# Altium schematic sheet relay.SchDoc
size B; SheetNumber: 2; SheetTotal: 6
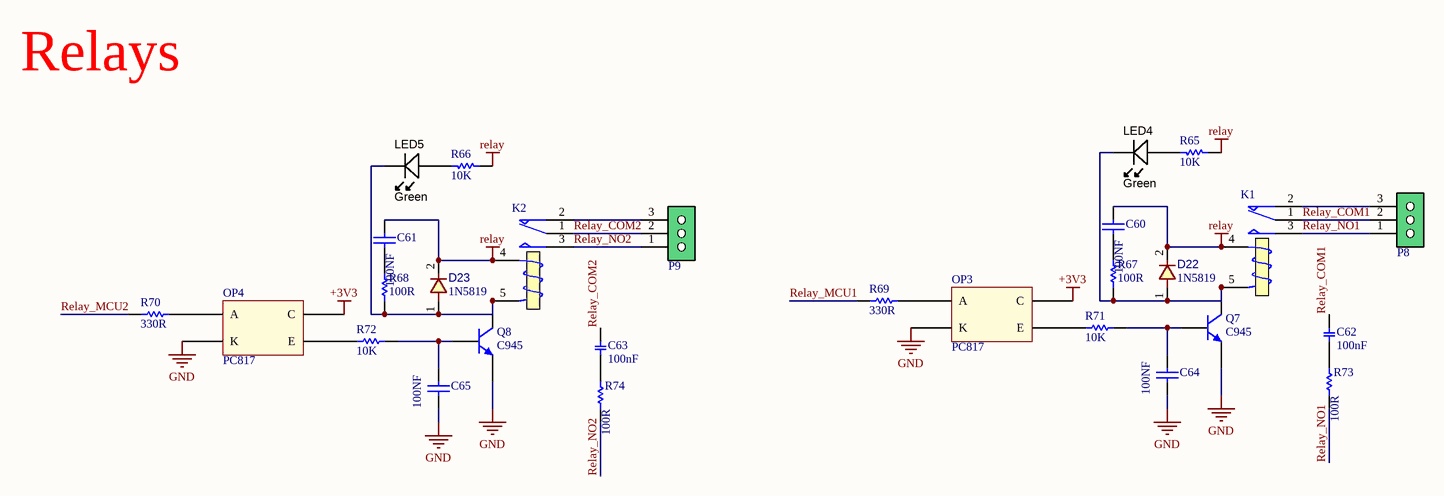
[diagram p0: relay.SchDoc]

## Parts
C60  100NF  [CAP0603]
C61  100NF  [CAP0603]
C62  100nF  [Cap - 10nF - 630V]
C63  100nF  [Cap - 10nF - 630V]
C64  100NF  [CAP0603]
C65  100NF  [CAP0603]
D22  value 1N5819  [D_SMA]  (hidden comment: 1n5819 SMD SS31)
D23  value 1N5819  [D_SMA]  (hidden comment: 1n5819 SMD SS31)
K1  (no value)  [Relay 18.85x15.35x15.70]
K2  (no value)  [Relay 18.85x15.35x15.70]
LED4  Green  [LED-0603-GREEN]
LED5  Green  [LED-0603-GREEN]
OP3  PC817  [PC817 SMD]
OP4  PC817  [PC817 SMD]
P8  Phoenix 3  [PRKR3A]  (value not drawn)
P9  Phoenix 3  [PRKR3A]  (value not drawn)
Q7  C945  [SOT23_N]
Q8  C945  [SOT23_N]
R65  10K  [R0603]
R66  10K  [R0603]
R67  100R  [R0603]
R68  100R  [R0603]
R69  330R  [R0603]
R70  330R  [R0603]
R71  10K  [R0603]
R72  10K  [R0603]
R73  100R  [SMD-2512-RES]
R74  100R  [SMD-2512-RES]

## Nets
+3V3: OP3.4(C) OP4.4(C)
GND: C64.1 C65.1 OP3.2(K) OP4.2(K) Q7.2(E) Q8.2(E)
relay: C60.2 C61.2 D22.2 D23.2 K1.4(T1) K2.4(T1) R65.2 R66.2
Relay_COM1: C62.2 K1.1(COM) P8.2
Relay_COM2: C63.2 K2.1(COM) P9.2
Relay_MCU1: R69.1
Relay_MCU2: R70.1
Relay_NO1: K1.3(NO) P8.1 R73.1
Relay_NO2: K2.3(NO) P9.1 R74.1
NetC60_1: C60.1 R67.1
NetC61_1: C61.1 R68.1
NetC62_1: C62.1 R73.2
NetC63_1: C63.1 R74.2
NetC64_2: C64.2 Q7.1(B) R71.1
NetC65_2: C65.2 Q8.1(B) R72.1
NetD22_1: D22.1 K1.5(T2) LED4.K Q7.3(C) R67.2
NetD23_1: D23.1 K2.5(T2) LED5.K Q8.3(C) R68.2
NetK1_2: K1.2(NC) P8.3
NetK2_2: K2.2(NC) P9.3
NetLED4_A: LED4.A R65.1
NetLED5_A: LED5.A R66.1
NetOP3_1: OP3.1(A) R69.2
NetOP3_3: OP3.3(E) R71.2
NetOP4_1: OP4.1(A) R70.2
NetOP4_3: OP4.3(E) R72.2

## Notes on the sheet
- Relays

## Library data of the parts
C60 C61 C64 C65 = CAP SMD PACKAGE: TOTAL CAPACITOR SMD PACK; Designer: Abbas Basereh; Desc.: CAP SMD TOTAL PACKAGES; Data: 2017-3-10; VALUE: 100nF
C62 C63 = Capacitor Polyester THD: DatasheetVersion: 2021; ComponentLink1Description: Website Smart World; ComponentLink1URL: https://www.smartw.ir/; ComponentLink2Description: Telegram; ComponentLink2URL: https://t.me/altium_smartw; ComponentLink3Description: Instagram; ComponentLink3URL: https://Instagram.com/smartgw.ir; Value: 100nF
D22 D23 = 1N4007 SMD M7: DIODE, GENERAL PURPOSE, 1000V/1A; DatasheetVersion: 2021; ComponentLink1Description: Website Smart World; ComponentLink1URL: https://www.smartw.ir/; ComponentLink2Description: Telegram; ComponentLink2URL: https://t.me/altium_smartw; ComponentLink3Description: Instagram; ComponentLink3URL: https://Instagram.com/smartgw.ir
K1 K2 = Relay_SPDT: Single-Pole Dual-Throw Relay; Designer: Abbas Basereh; Mounting Technology: Through-Hole; ComponentLink1Description: Datasheet; Pin Count: 0; Update Date: 2017-3-1
LED4 LED5 = LED_SMD_Green_0603_570nm: LED 0603 SMD Green 570nm 50mcd 20mA; Manufacturer 1: Kingbright Company LLC; Manufacturer Part Number 1: APT1608CGCK; Material: AlGaInP; Ratings: 20mcd min; 50 mcd typ; 570 nm; Voltage - Forward (Vf) Typ: 2.1V; Viewing Angle: 120°; Lens Style/Size: Rectangle with Flat Top, 1.1mm x 0.8mm; Voltage - Forward (Vf) @ 10mA: 2.0V; SCDType: source; Wavelength - Peak: 574nm; Lens Type: Clear; Package / Case: 0603 (1608 metric); Color: Green; Current - Test: 20mA; Supplier 1: Digi-Key; Supplier Part Number 1: 754-1116-1-ND; RoHS 1: RoHS Compliant; Wavelength - Dominant: 570nm; ComponentLink1URL: http://www.us.kingbright.com/images/catalog/SPEC/APT1608CGCK.pdf; ComponentLink1Description: http://www.us.kingbright.com/images/catalog/SPEC/APT1608CGCK.pdf
OP3 OP4 = PC817: PC817 optocpler; ComponentLink2Description: Website Smart World; ComponentLink2URL: https://www.smartw.ir/; ComponentLink3Description: Telegram; ComponentLink3URL: https://t.me/altium_smartw; ComponentLink4Description: Instagram; ComponentLink4URL: https://Instagram.com/smartgw.ir; DatasheetVersion: 2021
Q7 Q8 = C945: NPN Silicon Epitaxial Planar Transistor; Published: 2017-2-8; LatestRevisionDate: 2017; LatestRevisionNote: IPC-7351 Footprint Added.; DatasheetVersion: 2017; PackageVersion: 2017-2-8; PackageReference: SOT23; Publisher: Abbas Basereh; PackageDescription: 3-Pin SOT-23 Package 0.95 mm Pitch, 2.3 mm Lead Span; ComponentLink1Description: Manufacturer Link; ComponentLink1URL: http://www.taitroncomponents.com/; ComponentLink2Description: Datasheet; ComponentLink2URL: http://www.taitroncomponents.com/
R65-R72 = Resistor SMD 0603
  R67-R72: DatasheetVersion: 2021; ComponentLink1Description: Website Smart World; ComponentLink1URL: https://www.smartw.ir/; ComponentLink2Description: Telegram; ComponentLink2URL: https://t.me/altium_smartw; ComponentLink3Description: Instagram; ComponentLink3URL: https://Instagram.com/smartgw.ir
R73 R74 = Resistor SMD 2512: DatasheetVersion: 2021; ComponentLink1Description: Website Smart World; ComponentLink1URL: https://www.smartw.ir/; ComponentLink2Description: Telegram; ComponentLink2URL: https://t.me/altium_smartw; ComponentLink3Description: Instagram; ComponentLink3URL: https://Instagram.com/smartgw.ir
P8 P9 = Phoenix 3: ComponentLinkp-URL: https://www.smartw.ir/; DatasheetVersion: 2021; ComponentLink1Description: Website Smart World; ComponentLink1URL: https://www.smartw.ir/; ComponentLink2Description: Telegram; ComponentLink2URL: https://t.me/altium_smartw; ComponentLink3Description: Instagram; ComponentLink3URL: https://Instagram.com/smartgw.ir